# Altium schematic sheet Beagle.SchDoc
size A
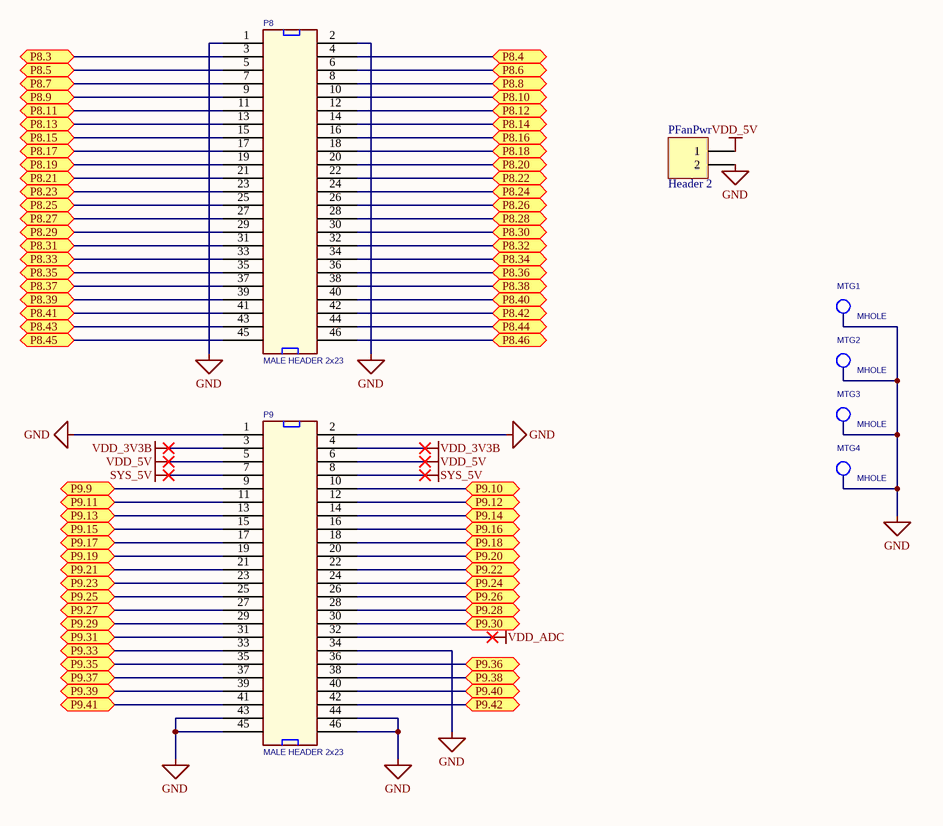
[diagram p0: Beagle.SchDoc]

## Parts
MTG1  MHOLE  [MTGH200C125D_PL]  (no BOM)
MTG2  MHOLE  [MTGH200C125D_PL]  (no BOM)
MTG3  MHOLE  [MTGH200C125D_PL]  (no BOM)
MTG4  MHOLE  [MTGH200C125D_PL]  (no BOM)
P8  MALE HEADER 2x23  [95278-101B46LF]
P9  MALE HEADER 2x23  [95278-101B46LF]
PFanPwr  Header 2  [HDR1X2]

## Ports
P8.3, P8.4, P8.5, P8.6, P8.7, P8.8, P8.9, P8.10, P8.11, P8.12, P8.13, P8.14, P8.15, P8.16, P8.17, P8.18, P8.19, P8.20, P8.21, P8.22, P8.23, P8.24, P8.25, P8.26, P8.27, P8.28, P8.29, P8.30, P8.31, P8.32, P8.33, P8.34, P8.35, P8.36, P8.37, P8.38, P8.39, P8.40, P8.41, P8.42, P8.43, P8.44, P8.45, P8.46, P9.9, P9.10, P9.11, P9.12, P9.13, P9.14, P9.15, P9.16, P9.17, P9.18, P9.19, P9.20, P9.21, P9.22, P9.23, P9.24, P9.25, P9.26, P9.27, P9.28, P9.29, P9.30, P9.31, P9.33, P9.35, P9.36, P9.37, P9.38, P9.39, P9.40, P9.41, P9.42

## Nets
GND: MTG1.1(TP) MTG2.1(TP) MTG3.1(TP) MTG4.1(TP) P8.1 P8.2 P9.1 P9.2 P9.34 P9.43 P9.44 P9.45 P9.46 PFanPwr.2
SYS_5V: P9.7 P9.8
VDD_3V3B: P9.3 P9.4
VDD_5V: P9.5 P9.6 PFanPwr.1
VDD_ADC: P9.32
P8.3: P8.3 ; port P8.3
P8.4: P8.4 ; port P8.4
P8.5: P8.5 ; port P8.5
P8.6: P8.6 ; port P8.6
P8.7: P8.7 ; port P8.7
P8.8: P8.8 ; port P8.8
P8.9: P8.9 ; port P8.9
P8.10: P8.10 ; port P8.10
P8.11: P8.11 ; port P8.11
P8.12: P8.12 ; port P8.12
P8.13: P8.13 ; port P8.13
P8.14: P8.14 ; port P8.14
P8.15: P8.15 ; port P8.15
P8.16: P8.16 ; port P8.16
P8.17: P8.17 ; port P8.17
P8.18: P8.18 ; port P8.18
P8.19: P8.19 ; port P8.19
P8.20: P8.20 ; port P8.20
P8.21: P8.21 ; port P8.21
P8.22: P8.22 ; port P8.22
P8.23: P8.23 ; port P8.23
P8.24: P8.24 ; port P8.24
P8.25: P8.25 ; port P8.25
P8.26: P8.26 ; port P8.26
P8.27: P8.27 ; port P8.27
P8.28: P8.28 ; port P8.28
P8.29: P8.29 ; port P8.29
P8.30: P8.30 ; port P8.30
P8.31: P8.31 ; port P8.31
P8.32: P8.32 ; port P8.32
P8.33: P8.33 ; port P8.33
P8.34: P8.34 ; port P8.34
P8.35: P8.35 ; port P8.35
P8.36: P8.36 ; port P8.36
P8.37: P8.37 ; port P8.37
P8.38: P8.38 ; port P8.38
P8.39: P8.39 ; port P8.39
P8.40: P8.40 ; port P8.40
P8.41: P8.41 ; port P8.41
P8.42: P8.42 ; port P8.42
P8.43: P8.43 ; port P8.43
P8.44: P8.44 ; port P8.44
P8.45: P8.45 ; port P8.45
P8.46: P8.46 ; port P8.46
P9.9: P9.9 ; port P9.9
P9.10: P9.10 ; port P9.10
P9.11: P9.11 ; port P9.11
P9.12: P9.12 ; port P9.12
P9.13: P9.13 ; port P9.13
P9.14: P9.14 ; port P9.14
P9.15: P9.15 ; port P9.15
P9.16: P9.16 ; port P9.16
P9.17: P9.17 ; port P9.17
P9.18: P9.18 ; port P9.18
P9.19: P9.19 ; port P9.19
P9.20: P9.20 ; port P9.20
P9.21: P9.21 ; port P9.21
P9.22: P9.22 ; port P9.22
P9.23: P9.23 ; port P9.23
P9.24: P9.24 ; port P9.24
P9.25: P9.25 ; port P9.25
P9.26: P9.26 ; port P9.26
P9.27: P9.27 ; port P9.27
P9.28: P9.28 ; port P9.28
P9.29: P9.29 ; port P9.29
P9.30: P9.30 ; port P9.30
P9.31: P9.31 ; port P9.31
P9.33: P9.33 ; port P9.33
P9.35: P9.35 ; port P9.35
P9.36: P9.36 ; port P9.36
P9.37: P9.37 ; port P9.37
P9.38: P9.38 ; port P9.38
P9.39: P9.39 ; port P9.39
P9.40: P9.40 ; port P9.40
P9.41: P9.41 ; port P9.41
P9.42: P9.42 ; port P9.42

## Library data of the parts
P8 P9 = HDR_46_F_2_0.1_0.1: CONN HEADER FMAL 46PS.1" DL GOLD; Manufacturer: Sullins Connector Solutions; Number of Positions: 46; Number of Positions Loaded: All; Pitch: 0.100" (2.54mm); Supplier 1: Digi-Key; Supplier Part Number 1: S7126-ND; RoHS: RoHS Compliant; Category: Connectors, Interconnects; Stock 1: 750; Pricing 1: 1=2.75, 10=2.325, 25=2.2196, 50=2.0084, 100=1.7969, 250=1.58552, 500=1.4798, 1000=1.3741, 2500=1.32125 (USD); Connector Type: Header; Contact Type: Female Socket; Number of Rows: 2; Row Spacing: 0.100" (2.54mm); Mounting Type: Through Hole; Termination: Solder; Fastening Type: -; Features: -; Contact Finish: Gold; Contact Finish Thickness: Flash; Color: Black; Packaging: Bulk; ComponentLink1URL: http://www.sullinscorp.com/drawings/78_P(N)PxCxxxLFBN-RC,_10492-G.pdf; ComponentLink1Description: http://www.sullinscorp.com/drawings/78_P(N)PxCxxxLFBN-RC,_10492-G.pdf
PFanPwr = Header 2: Header, 2-Pin; LatestRevisionDate: 17-Jul-2002; LatestRevisionNote: Re-released for DXP Platform.; Publisher: Altium Limited